# Altium schematic sheet LVDS.SchDoc: LVDS
size A3; Date: Not used; ApprovedBy: Not used; CheckedBy: Not used; Author: Not used; CompanyName: STMicroelectronics; DrawnBy: Not used; Engineer: Not used; Organization: Not used; Address1: Not used; Address2: Not used; Address3: Not used; Address4: Not used; DocumentNumber: Not used; Revision: Not used; SheetNumber: 9; SheetTotal: 18; CurrentTime: Not used; CurrentDate: Not used; Time: Not used; DocumentFullPathAndName: Not used; DocumentName: Not used; ModifiedDate: Not used; ImagePath: Not used; ProjectName: Not used; Application_BuildNumber: Not used
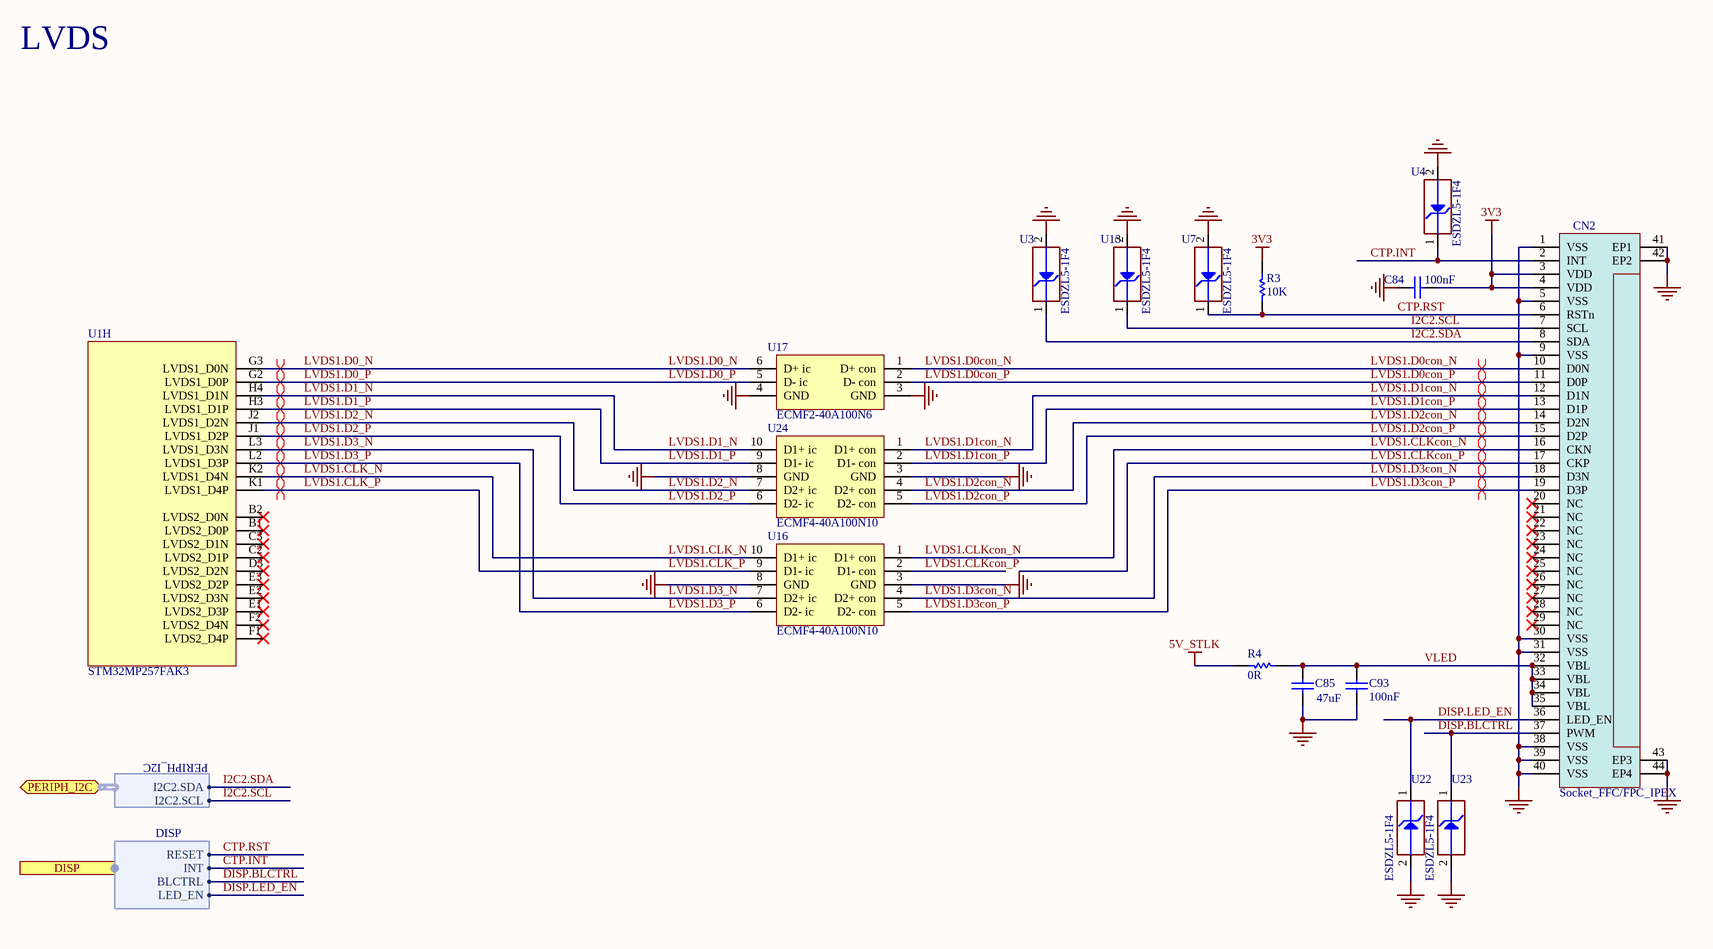
[diagram p0: LVDS.SchDoc]

## Parts
C84  value 100nF  [C0402]  (hidden comment: Capacitor)
C85  value 47uF  [C0805]  (hidden comment: Capacitor)
C93  value 100nF  [C0402]  (hidden comment: Capacitor)
CN2  value Socket_FFC/FPC_IPEX  [CON_I-PEX_20455-040E-76]  (hidden comment: IPEX20455)
R3  value 10K  [R0402]  (hidden comment: Resistor)
R4  value 0R  [R0805]  (hidden comment: Resistor)
U1  STM32MP257FAK3  [ICC_TFBGA424_14X14_P050_H1P20_CODE-B0A2]  (part H of 9)
U3  value ESDZL5-1F4  [ESD_ST0201]  (hidden comment: ESD-TRANSIL)
U4  value ESDZL5-1F4  [ESD_ST0201]  (hidden comment: ESD-TRANSIL)
U7  value ESDZL5-1F4  [ESD_ST0201]  (hidden comment: ESD-TRANSIL)
U13  value ESDZL5-1F4  [ESD_ST0201]  (hidden comment: ESD-TRANSIL)
U16  ECMF4-40A100N10  [ESD_UQFN-10L_2P25X1P4_P040]
U17  ECMF2-40A100N6  [ESD_UQFN-6L_1P45X1P4_P040]
U22  value ESDZL5-1F4  [ESD_ST0201]  (hidden comment: ESD-TRANSIL)
U23  value ESDZL5-1F4  [ESD_ST0201]  (hidden comment: ESD-TRANSIL)
U24  ECMF4-40A100N10  [ESD_UQFN-10L_2P25X1P4_P040]

## Ports
DISP (harness DISP), PERIPH_I2C (bidir, harness PERIPH_I2C)

## Harnesses
DISP: RESET, INT, BLCTRL, LED_EN
PERIPH_I2C: I2C2.SDA, I2C2.SCL

## Nets
3V3: C84.2 CN2.3(VDD) CN2.4(VDD) R3.1
5V_STLK: R4.2
GND: C84.1 C85.1 C93.1 CN2.1(VSS) CN2.5(VSS) CN2.9(VSS) CN2.30(VSS) CN2.31(VSS) CN2.38(VSS) CN2.39(VSS) CN2.40(VSS) CN2.41(EP1) CN2.42(EP2) CN2.43(EP3) CN2.44(EP4) U3.2(GND) U4.2(GND) U7.2(GND) U13.2(GND) U16.3(GND) U16.8(GND) U17.3(GND) U17.4(GND) U22.2(GND) U23.2(GND) U24.3(GND) U24.8(GND)
CTP.INT: CN2.2(INT) U4.1(IO1) ; port DISP.INT
CTP.RST: CN2.6(RSTn) R3.2 U7.1(IO1) ; port DISP.RESET
DISP.BLCTRL: CN2.37(PWM) U23.1(IO1) ; port DISP.BLCTRL
DISP.LED_EN: CN2.36(LED_EN) U22.1(IO1) ; port DISP.LED_EN
I2C2.SCL: CN2.7(SCL) U13.1(IO1) ; port PERIPH_I2C.I2C2.SCL
I2C2.SDA: CN2.8(SDA) U3.1(IO1) ; port PERIPH_I2C.I2C2.SDA
LVDS1.CLK_N: U1.K2(LVDS1_D4N) U16.10(D1+_ic)
LVDS1.CLK_P: U1.K1(LVDS1_D4P) U16.9(D1-_ic)
LVDS1.CLKcon_N: CN2.16(CKN) U16.1(D1+_con)
LVDS1.CLKcon_P: CN2.17(CKP) U16.2(D1-_con)
LVDS1.D0_N: U1.G3(LVDS1_D0N) U17.6(D+_ic)
LVDS1.D0_P: U1.G2(LVDS1_D0P) U17.5(D-_ic)
LVDS1.D0con_N: CN2.10(D0N) U17.1(D+_con)
LVDS1.D0con_P: CN2.11(D0P) U17.2(D-_con)
LVDS1.D1_N: U1.H4(LVDS1_D1N) U24.10(D1+_ic)
LVDS1.D1_P: U1.H3(LVDS1_D1P) U24.9(D1-_ic)
LVDS1.D1con_N: CN2.12(D1N) U24.1(D1+_con)
LVDS1.D1con_P: CN2.13(D1P) U24.2(D1-_con)
LVDS1.D2_N: U1.J2(LVDS1_D2N) U24.7(D2+_ic)
LVDS1.D2_P: U1.J1(LVDS1_D2P) U24.6(D2-_ic)
LVDS1.D2con_N: CN2.14(D2N) U24.4(D2+_con)
LVDS1.D2con_P: CN2.15(D2P) U24.5(D2-_con)
LVDS1.D3_N: U1.L3(LVDS1_D3N) U16.7(D2+_ic)
LVDS1.D3_P: U1.L2(LVDS1_D3P) U16.6(D2-_ic)
LVDS1.D3con_N: CN2.18(D3N) U16.4(D2+_con)
LVDS1.D3con_P: CN2.19(D3P) U16.5(D2-_con)
VLED: C85.2 C93.2 CN2.32(VBL) CN2.33(VBL) CN2.34(VBL) CN2.35(VBL) R4.1

Not connected (* = marked no-connect by the designer): CN2 20(NC)* 21(NC)* 22(NC)* 23(NC)* 24(NC)* 25(NC)* 26(NC)* 27(NC)* 28(NC)* 29(NC)*; U1 B1(LVDS2_D0P)* B2(LVDS2_D0N)* C2(LVDS2_D1P)* C3(LVDS2_D1N)* D3(LVDS2_D2N)* E1(LVDS2_D3P)* E2(LVDS2_D3N)* E3(LVDS2_D2P)* F1(LVDS2_D4P)* F2(LVDS2_D4N)*

## Layout directives
differential pair: LVDS1.CLK_N, LVDS1.CLK_P, LVDS1.CLKcon_N, LVDS1.CLKcon_P, LVDS1.D0_N, LVDS1.D0_P, LVDS1.D0con_N, LVDS1.D0con_P, LVDS1.D1_N, LVDS1.D1_P, LVDS1.D1con_N, LVDS1.D1con_P, LVDS1.D2_N, LVDS1.D2_P, LVDS1.D2con_N, LVDS1.D2con_P, LVDS1.D3_N, LVDS1.D3_P, LVDS1.D3con_N, LVDS1.D3con_P

## Notes on the sheet
- LVDS
- Title:
- Project:
- Size:
- Revision:
- Variant:
- A3
- -
- Date:
- Reference:
- Sheet:
- of

## Library data of the parts
C84 C93 = MCD-02352: Capacitor, MLCC, 100nF, 10V, X5R, +/-10%, 0402, T=0,5mm; Part_Preference: Recommended; Manufacturer: YAGEO; Manufacturer_Part_Number: CC0402KRX5R6BB104; Component_Country_Of_Origin: China; ShowFields: YES; ID: 4458; Internal_Part_Number: MCD-02352; Status: Checked; Part_Type: Capacitor; Package: 0402; ComponentLink1URL: http://tunmcdsvn.tun.st.com/Component_Documentation_Library/Trunk/Capacitor/YAGEO_X5R_Series; Order_Code_Digikey: 311-1336-2-ND; Order_Code_Farnell: 2370637; Order_Code_RS: N/A
C85 = MCD-00204: Capacitor, MLCC, 47uF, 10V, X5R, +/-20%, 0805, T=1.25mm; Part_Preference: Recommended; Manufacturer: MURATA; Manufacturer_Part_Number: GRM21BR61A476ME15K; Component_Country_Of_Origin: Japan; ShowFields: YES; ID: 2664; Internal_Part_Number: MCD-00204; Status: Checked; Part_Type: Capacitor; Package: 0805; ComponentLink1URL: http://tunmcdsvn.tun.st.com/Component_Documentation_Library/Trunk/Capacitor/MURATA_GRM_Series; Order_Code_Digikey: GRM21BR61A476ME15K-ND; Order_Code_Farnell: N/A; Order_Code_RS: N/A
CN2 = MCD-03562: Socket_FFC/FPC, 40pins, 0.5mm, RA, SMD, T=1mm; Part_Type: Connector; Part_Preference: Recommended; Manufacturer: I-PEX; Manufacturer_Part_Number: 20455-040E-76; Component_Country_Of_Origin: Singapore; ShowFields: YES; ID: 5678; Internal_Part_Number: MCD-03562; Status: Released; ComponentLink1URL: http://tunmcdsvn.tun.st.com/Component_Documentation_Library/Trunk/Connector/I-PEX_20455-040E-76; Order_Code_Digikey: 3508-20455-040E-76TR-ND; Order_Code_Farnell: N/A; Order_Code_RS: N/A
R3 = MCD-00053: Resistor, 10K, 0402, +/-1%, 1/16W; BMS_Part_Number: 9131590; Part_Preference: Recommended; Manufacturer: YAGEO; Manufacturer_Part_Number: RC0402FR-0710KL; Component_Country_Of_Origin: China; ID: 2539; ShowFields: YES; Internal_Part_Number: MCD-00053; Status: Released; Part_Type: Resistor; Package: 0402; ComponentLink1URL: http://tunmcdsvn.tun.st.com/Component_Documentation_Library/Trunk/Resistor/YAGEO_RC_L_Series; Order_Code_Digikey: 311-10.0KLRCT-ND; Order_Code_Farnell: 9239359; Order_Code_RS: N/A
R4 = MCD-00179: Resistor, 0R, 0805, +/-5%, 1/8W; Part_Preference: Recommended; Manufacturer: YAGEO; Manufacturer_Part_Number: RC0805JR-070RL; Component_Country_Of_Origin: China; ID: 2685; ShowFields: YES; Internal_Part_Number: MCD-00179; Status: Released; Part_Type: Resistor; Package: 0805; ComponentLink1URL: http://tunmcdsvn.tun.st.com/Component_Documentation_Library/Trunk/Resistor/YAGEO_RC_L_Series; Order_Code_Digikey: 311-0.0ARCT-ND; Order_Code_Farnell: 9233750; Order_Code_RS: N/A
U1 = MCD-03375: MPU , 2xCortex-A35@1.5GHz, Cortex-M33@400MHz, TFBGA 14x14, pitch 0.5, 648KB SRAM, With Crypto; Part_Type: IC; Part_Preference: Recommended; Manufacturer: STMICROELECTRONICS; Component_Country_Of_Origin: Unknown; ShowFields: YES; ID: 5491; Value: STM32MP257FAK3; Internal_Part_Number: MCD-03375; Status: Checked; Manufacturer_Part_Number: STM32MP257FAK3; Package: TFBGA; ComponentLink1URL: http://tunmcdsvn.tun.st.com/Component_Documentation_Library/Trunk/IC/STMICROELECTRONICS_STM32MP257FAK3; Order_Code_Digikey: N/A; Order_Code_Farnell: N/A; Order_Code_RS: N/A
U3 U4 U7 U13 U22 U23 = MCD-03501: ESD protection , 0201; Part_Type: IC; Part_Preference: Recommended; Manufacturer: STMICROELECTRONICS; ShowFields: YES; ID: 5617; Order_Code_RS: 163-7318; Internal_Part_Number: MCD-03501; Status: New; Manufacturer_Part_Number: ESDZL5-1F4; ComponentLink1URL: http://tunmcdsvn.tun.st.com/Component_Documentation_Library/Trunk/IC/STMICROELECTRONICS_ESDZL5-1F4; Full_Alternate_Internal_Part_Number: N/A; Order_Code_Digikey: 497-17544-2-ND; Order_Code_Farnell: ESDZL5-1F4; Package: 0201
U16 U24 = MCD-03059: ESD protection & Common Filter High Speed serial Interfaces , 0.4 pitch; Part_Type: IC; Part_Preference: Recommended; Manufacturer: STMICROELECTRONICS; ShowFields: YES; ID: 5175; Component_Country_Of_Origin: China; ComponentLink1Description: Datasheet; ComponentLink1URL: http://tunmcdsvn.tun.st.com/Component_Documentation_Library/Trunk/IC/STMICROELECTRONICS_ECMF4-40A100N10; Internal_Part_Number: MCD-03059; Value: ECMF4-40A100N10; Status: Checked; Manufacturer_Part_Number: ECMF4-40A100N10; Package: uQFN-10L; Order_Code_Digikey: 497-ECMF4-40A100N10; Order_Code_Farnell: N/A; Order_Code_RS: N/A
U17 = MCD-03060: ESD protection & Common Filter High Speed serial Interfaces , 0.4 pitch; Part_Type: IC; Part_Preference: Recommended; Manufacturer: STMICROELECTRONICS; ShowFields: YES; ID: 5176; Component_Country_Of_Origin: China; ComponentLink1Description: Datasheet; ComponentLink1URL: http://tunmcdsvn.tun.st.com/Component_Documentation_Library/Trunk/IC/STMICROELECTRONICS_ECMF4-40A100N10; Internal_Part_Number: MCD-03060; Value: ECMF2-40A100N6; Status: Checked; Manufacturer_Part_Number: ECMF2-40A100N6; Package: uQFN-6; Order_Code_Digikey: 497-ECMF2-40A100N6; Order_Code_Farnell: 3993603; Order_Code_RS: N/A